# EAGLE design Buzzer_imp (EAGLE 6.4)
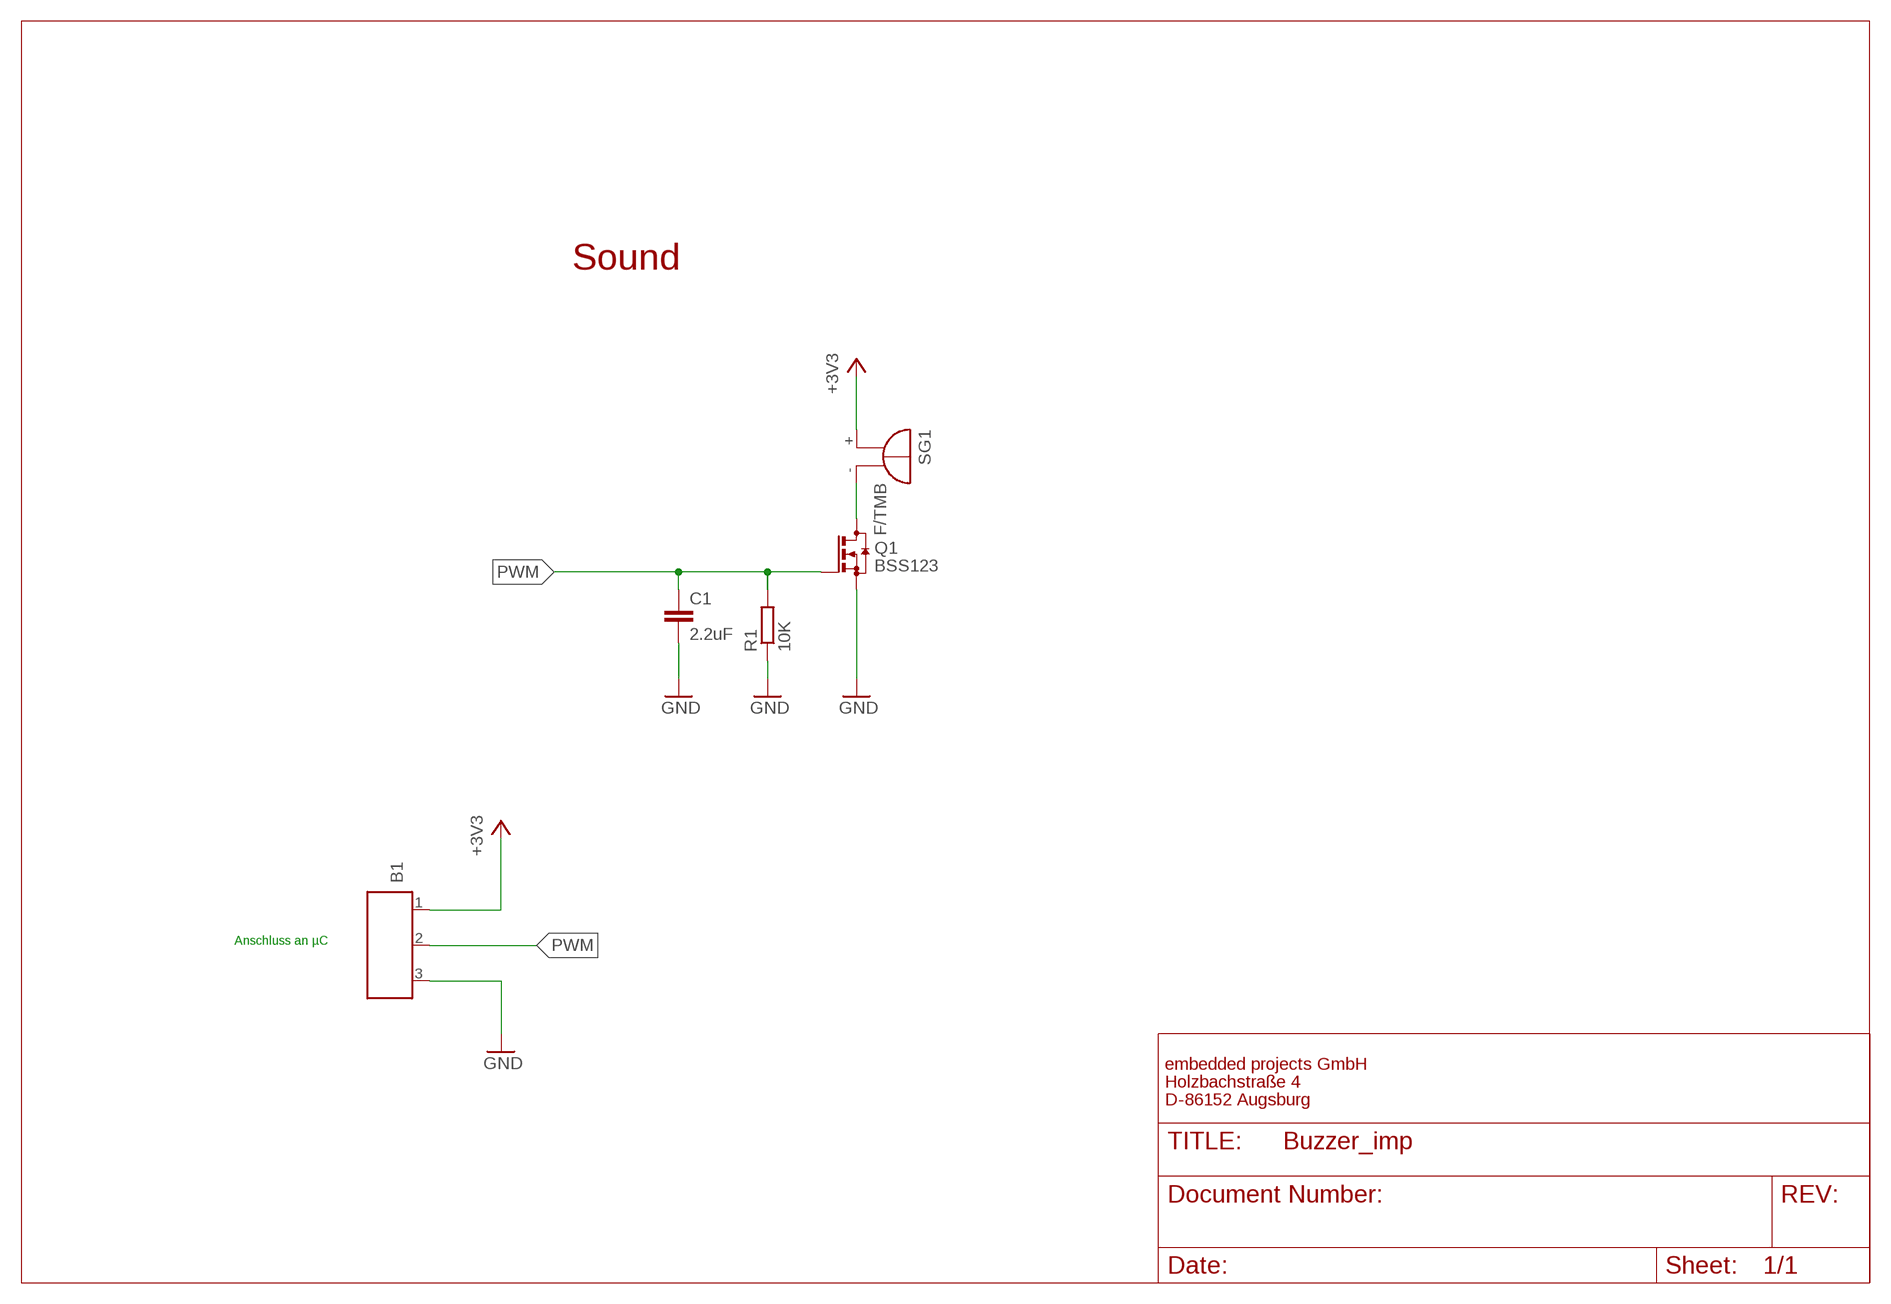
[diagram p0: schematic, sheet 1]

## Parts
B1  MESSFUEHLER_3  [MESSFUEHLER_3]
C1  2.2uF  C-EUC0805  [C0805]
Q1  BSS123  [SOT-23]
R1  10K  R-EU_R0805  [R0805]
SG1  F/TMB  [F/TMB]

## Nets
+3V3: B1.1 SG1.+
GND: B1.3 C1.2 Q1.2(S) R1.1
N$22: Q1.3(D) SG1.-
PWM: B1.2 C1.1 Q1.1(G) R1.2

## Notes on the sheet
- Sound
- Anschluss an µC
- embedded projects GmbH
- Holzbachstraße 4
- D-86152 Augsburg

## Library data of the parts
B1 = e-messfuehler:MESSFUEHLER_3: Messfühler mit drei Anschlüssen, 2 Versorgung, 1 Signal
C1 = rcl:C-EU: CAPACITOR, European symbol
Q1 = EmbeddedProjectsBauteile:BSS123: N-CHANNEL MOS FET; EP: 400196
R1 = rcl:R-EU_: RESISTOR, European symbol
SG1 = buzzer:F/TMB: BUZZER Source: Buerklin; OC_FARNELL: unknown; OC_NEWARK: unknown

## Board
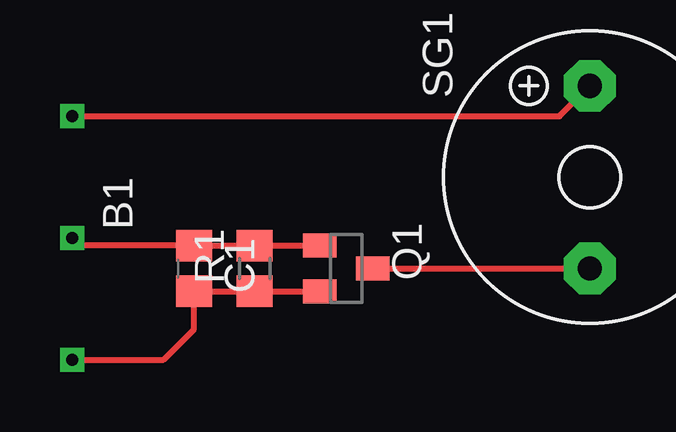
[diagram p1: board, top side]

No outline drawn. Coordinates in mm, seen from the top.
Copper layers (1*16): Top 0.035mm / dielectric 1.5mm / Bottom 0.035mm
Design rules "default": minimum track width 10mil, minimum drill 24mil, track to track 8mil, track to pad 8mil, pad to pad 8mil, via to via 8mil, smd to smd 8mil, copper to edge 40mil, drill to drill 8mil, minimum pad ring 10mil, minimum via ring 8mil, stop-mask expansion 4mil, vias tented up to drill 0mil, thermal gap 10mil

### Footprints (pad centres in the part's own frame; a part is rotated, then mirrored left to right if it is on the bottom)
MESSFUEHLER_3 = drill 0.5 pad 1 square: 1 -5.08,0; 2 0,0; 3 5.08,0
C0805 = smd 1.3 x 1.5: 1 -0.95,0; 2 0.95,0
SOT-23 = smd 1 x 1.4: 1 -0.95,-1.1; 2 0.95,-1.1; 3 0,1.1
R0805 = smd 1.3 x 1.5: 1 -0.95,0; 2 0.95,0
F/TMB = drill 1.016 pad 2.159 octagon: + 3.81,0; - -3.81,0

### Placement (x,y rotation side)
B1  2.54,15.24 270 top
C1  7.62,13.97 270 top
Q1  13.97,13.97 270 top
R1  10.16,13.97 90 top
SG1  24.13,17.78 90 top

### Tracks (layer width: path | path; a pad name or v marks a point on that pad's centre or on a via)
+3V3
  Top 0.254: B1.1 22.86,20.32 SG1.+
GND
  Top 0.254: Q1.2 R1.1 C1.2 7.62,11.43 6.35,10.16 B1.3
N$22
  Top 0.254: Q1.3 SG1.-
PWM
  Top 0.254: Q1.1 R1.2 C1.1 2.86,14.92 B1.2